# EAGLE board PC_adder (EAGLE 9.4.2), part 1 of 2
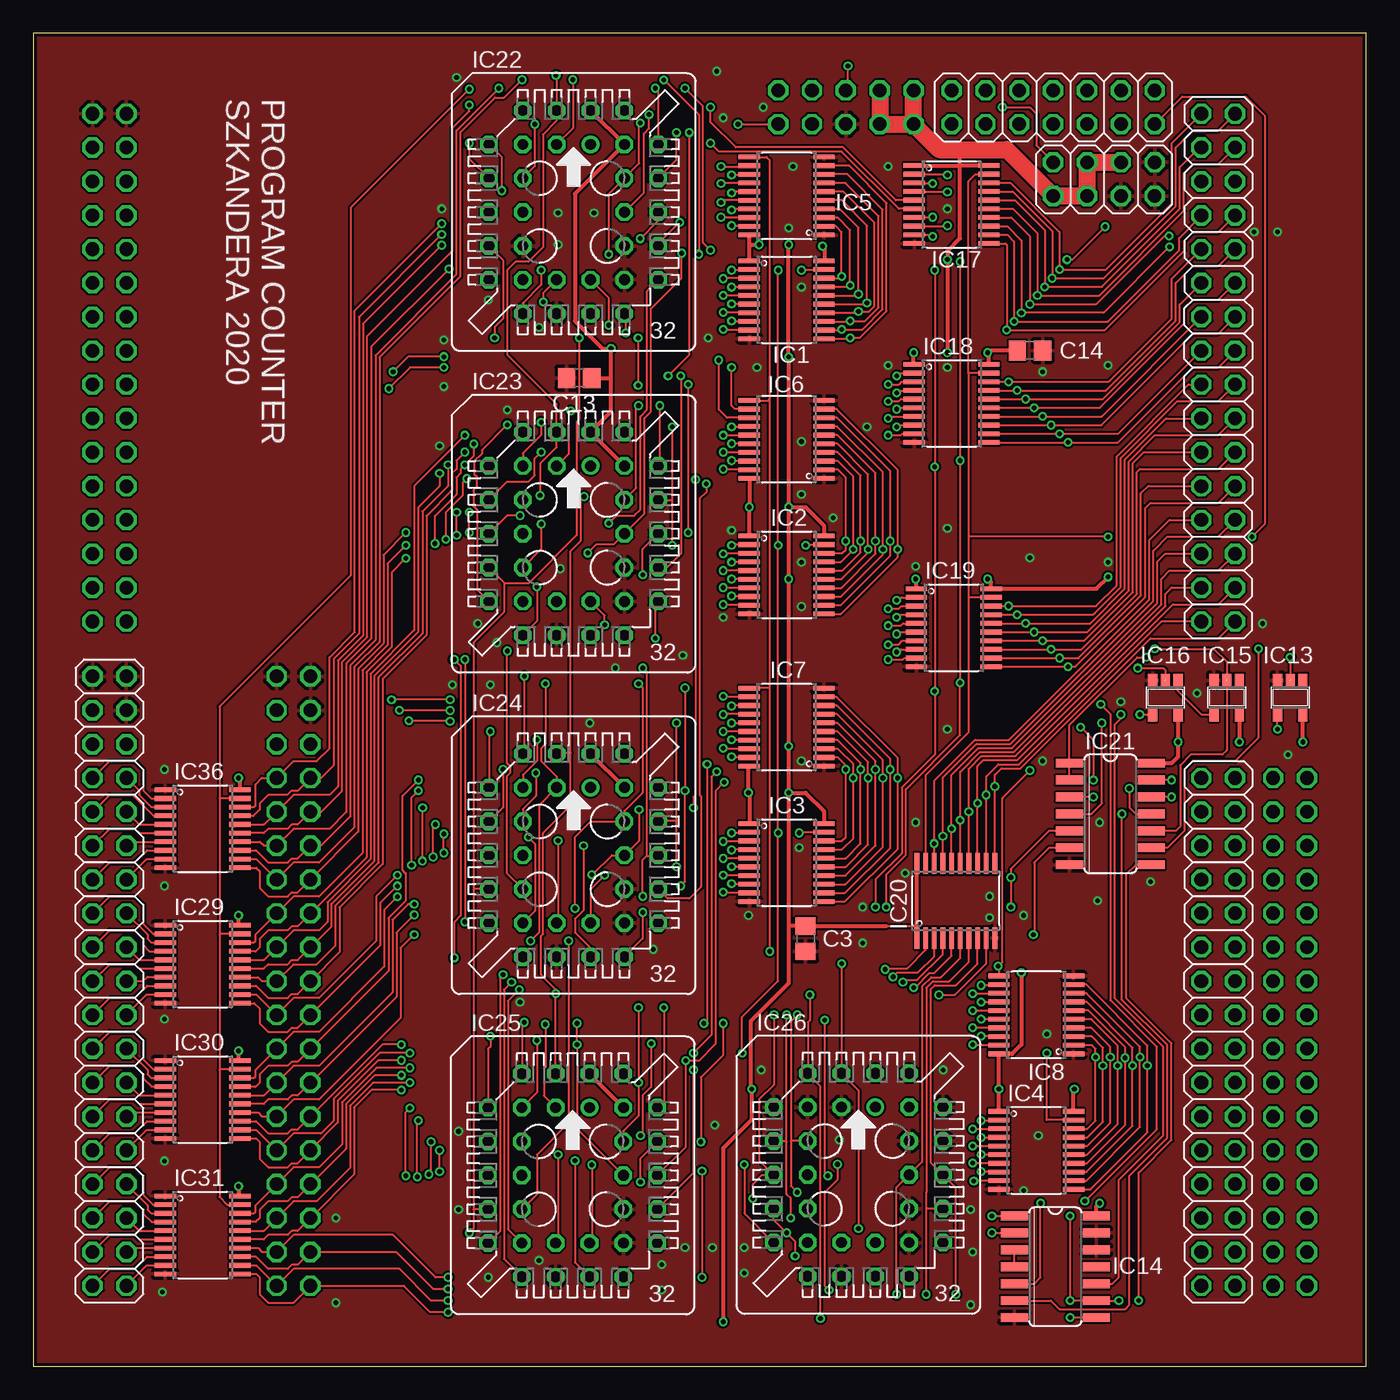
[diagram p2: board, top side]
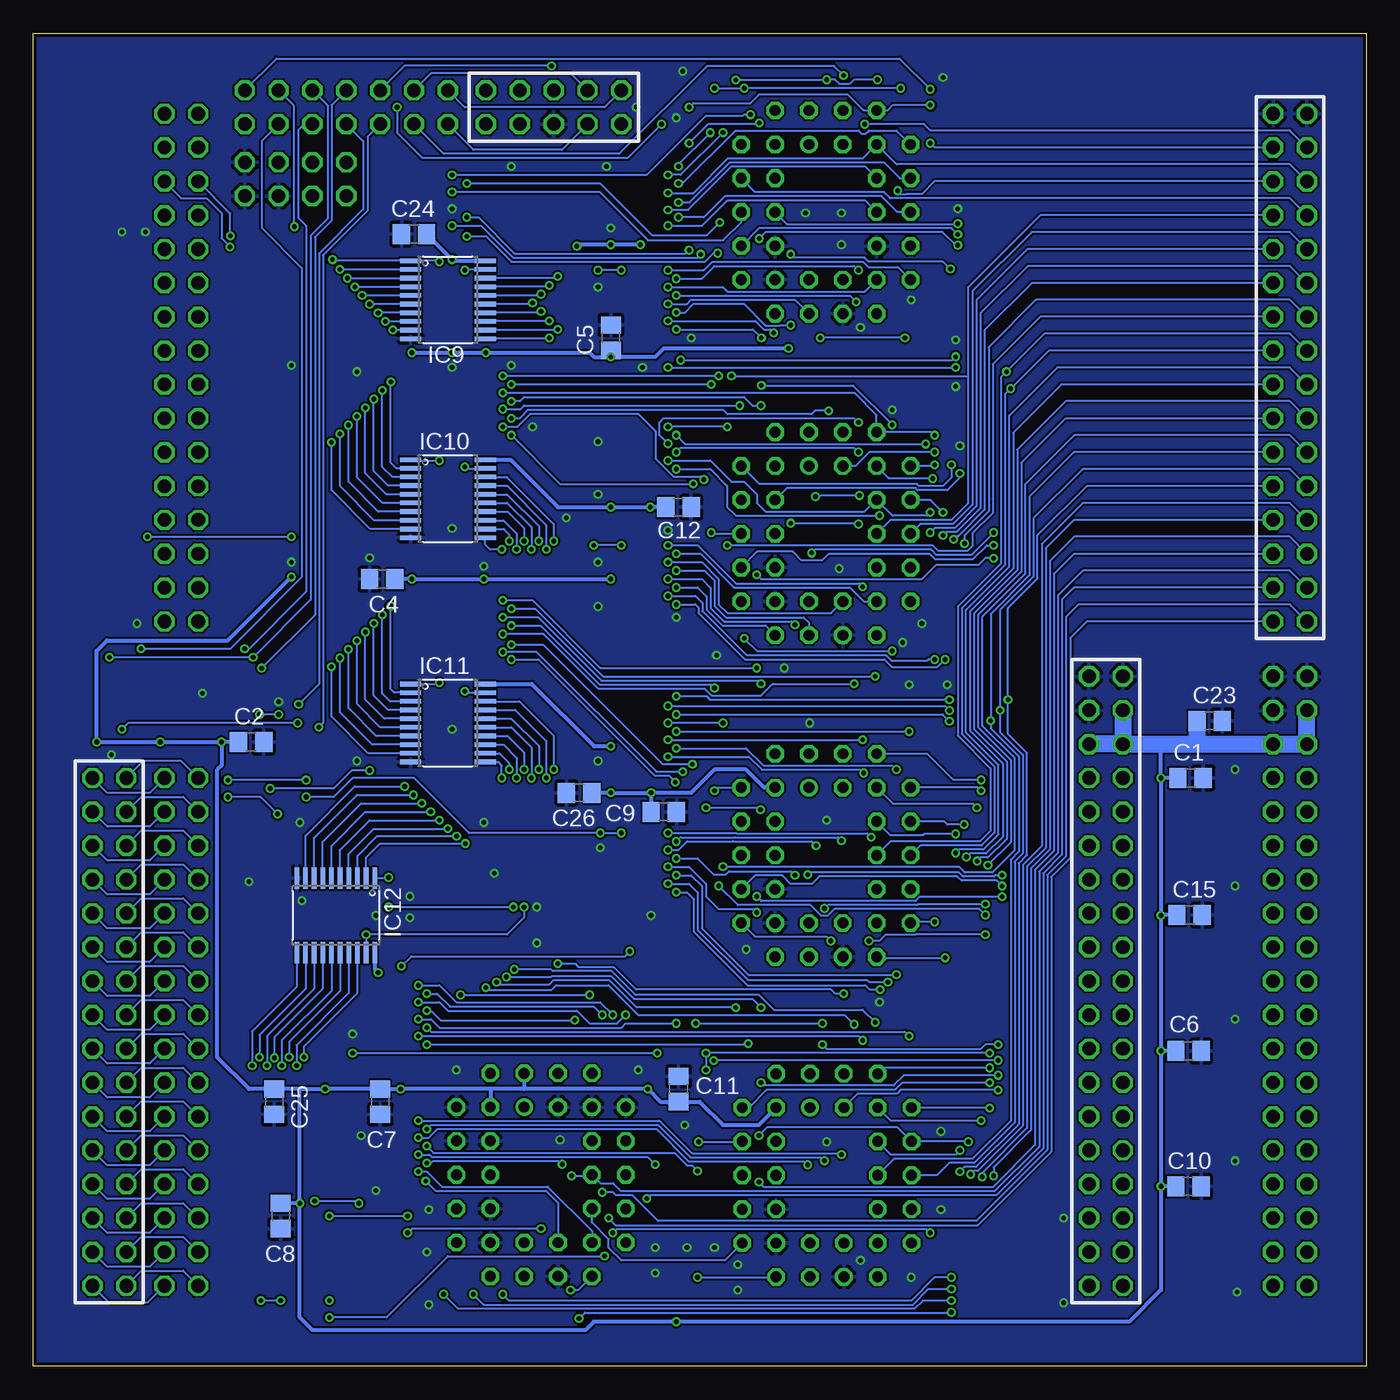
[diagram p3: board, bottom side, seen from below]

Size 100 x 100 mm. Coordinates in mm from the lower left corner, seen from the top.
Outline: 0,0 100,0 100,100 0,100 0,0
Copper layers (1*16): Top 0.035mm / dielectric 1.5mm / Bottom 0.035mm
Design rules "SeeedStudio_2layer_DRU_no_angle_20140221 *": minimum track width 6mil, minimum drill 12mil, track to track 6mil, track to pad 6mil, pad to pad 6mil, via to via 6mil, smd to smd 0mil, copper to edge 10mil, drill to drill 10mil, minimum pad ring 10mil, minimum via ring 6mil, stop-mask expansion 2mil, vias tented up to drill 100mil, thermal gap 10mil

## Footprints (pad centres in the part's own frame; a part is rotated, then mirrored left to right if it is on the bottom)
2X19 = drill 1.016 octagon: 1 -22.86,-1.27; 2 -22.86,1.27; 3 -20.32,-1.27; 4 -20.32,1.27; 5 -17.78,-1.27; 6 -17.78,1.27; 7 -15.24,-1.27; 8 -15.24,1.27; 9 -12.7,-1.27; 10 -12.7,1.27; 11 -10.16,-1.27; 12 -10.16,1.27; 13 -7.62,-1.27; 14 -7.62,1.27; 15 -5.08,-1.27; 16 -5.08,1.27; 17 -2.54,-1.27; 18 -2.54,1.27; 19 0,-1.27; 20 0,1.27; 21 2.54,-1.27; 22 2.54,1.27; 23 5.08,-1.27; 24 5.08,1.27; 25 7.62,-1.27; 26 7.62,1.27; 27 10.16,-1.27; 28 10.16,1.27; 29 12.7,-1.27; 30 12.7,1.27; 31 15.24,-1.27; 32 15.24,1.27; 33 17.78,-1.27; 34 17.78,1.27; 35 20.32,-1.27; 36 20.32,1.27; 37 22.86,-1.27; 38 22.86,1.27
C0805 = smd 1.3 x 1.5: 1 -0.95,0; 2 0.95,0
TSSOP20 = smd 0.35 x 1.6: 1 -2.925,-2.8; 2 -2.275,-2.8; 3 -1.625,-2.8; 4 -0.975,-2.8; 5 -0.325,-2.8; 6 0.325,-2.8; 7 0.975,-2.8; 8 1.625,-2.8; 9 2.275,-2.8; 10 2.925,-2.8; 11 2.925,2.8; 12 2.275,2.8; 13 1.625,2.8; 14 0.975,2.8; 15 0.325,2.8; 16 -0.325,2.8; 17 -0.975,2.8; 18 -1.625,2.8; 19 -2.275,2.8; 20 -2.925,2.8
SOT23-5 = smd 0.69 x 0.99: 1 -0.95,-1.29; 2 0,-1.29; 3 0.95,-1.29; 4 0.95,1.3; 5 -0.95,1.3
SO14 = smd 0.66 x 2.032: 1 -3.81,-3.073; 2 -2.54,-3.073; 3 -1.27,-3.073; 4 0,-3.073; 5 1.27,-3.073; 6 2.54,-3.073; 7 3.81,-3.073; 8 3.81,3.073; 9 2.54,3.073; 10 1.27,3.073; 11 0,3.073; 12 -1.27,3.073; 13 -2.54,3.073; 14 -3.81,3.073
S32 = drill 0.813: 1 1.27,5.08 | drill 0.813 octagon: 2 -1.27,7.62; 3 -1.27,5.08; 4 -3.81,7.62; 5 -6.35,5.08; 6 -3.81,5.08; 7 -6.35,2.54; 8 -3.81,2.54; 9 -6.35,0; 10 -3.81,0; 11 -6.35,-2.54; 12 -3.81,-2.54; 13 -6.35,-5.08; 14 -3.81,-7.62; 15 -3.81,-5.08; 16 -1.27,-7.62; 17 -1.27,-5.08; 18 1.27,-7.62; 19 1.27,-5.08; 20 3.81,-7.62; 21 6.35,-5.08; 22 3.81,-5.08; 23 6.35,-2.54; 24 3.81,-2.54; 25 6.35,0; 26 3.81,0; 27 6.35,2.54; 28 3.81,2.54; 29 6.35,5.08; 30 3.81,7.62; 31 3.81,5.08; 32 1.27,7.62
2X16 = drill 1.016 octagon: 1 -19.05,-1.27; 2 -19.05,1.27; 3 -16.51,-1.27; 4 -16.51,1.27; 5 -13.97,-1.27; 6 -13.97,1.27; 7 -11.43,-1.27; 8 -11.43,1.27; 9 -8.89,-1.27; 10 -8.89,1.27; 11 -6.35,-1.27; 12 -6.35,1.27; 13 -3.81,-1.27; 14 -3.81,1.27; 15 -1.27,-1.27; 16 -1.27,1.27; 17 1.27,-1.27; 18 1.27,1.27; 19 3.81,-1.27; 20 3.81,1.27; 21 6.35,-1.27; 22 6.35,1.27; 23 8.89,-1.27; 24 8.89,1.27; 25 11.43,-1.27; 26 11.43,1.27; 27 13.97,-1.27; 28 13.97,1.27; 29 16.51,-1.27; 30 16.51,1.27; 31 19.05,-1.27; 32 19.05,1.27
2X05 = drill 1.016 octagon: 1 -5.08,-1.27; 2 -5.08,1.27; 3 -2.54,-1.27; 4 -2.54,1.27; 5 0,-1.27; 6 0,1.27; 7 2.54,-1.27; 8 2.54,1.27; 9 5.08,-1.27; 10 5.08,1.27
2X04 = drill 1.016 octagon: 1 -3.81,-1.27; 2 -3.81,1.27; 3 -1.27,-1.27; 4 -1.27,1.27; 5 1.27,-1.27; 6 1.27,1.27; 7 3.81,-1.27; 8 3.81,1.27
2X07 = drill 1.016 octagon: 1 -7.62,-1.27; 2 -7.62,1.27; 3 -5.08,-1.27; 4 -5.08,1.27; 5 -2.54,-1.27; 6 -2.54,1.27; 7 0,-1.27; 8 0,1.27; 9 2.54,-1.27; 10 2.54,1.27; 11 5.08,-1.27; 12 5.08,1.27; 13 7.62,-1.27; 14 7.62,1.27

## Placement (x,y rotation side)
ALU_Y_C0  [2X19]  5.71,28.89 270 top
C1  [C0805]  13.18,44.13 0 bottom
C2  [C0805]  83.66,46.83 0 bottom
C3  [C0805]  57.94,32.07 270 top
C4  [C0805]  73.82,59.05 180 bottom
C5  [C0805]  56.67,77.15 90 bottom
C6  [C0805]  13.34,23.65 0 bottom
C7  [C0805]  73.98,19.84 270 bottom
C8  [C0805]  81.44,11.27 270 bottom
C9  [C0805]  52.7,41.59 0 bottom
C10  [C0805]  13.34,13.49 0 bottom
C11  [C0805]  51.59,20.8 90 bottom
C12  [C0805]  51.59,64.45 0 bottom
C13  [C0805]  40.96,74.14 180 top
C14  [C0805]  74.78,76.2 0 top
C15  [C0805]  13.26,33.86 0 bottom
C23  1u  [C0805]  11.75,48.42 0 bottom
C24  1u  [C0805]  71.44,84.93 180 bottom
C25  1u  [C0805]  81.92,19.84 270 bottom
C26  1u  [C0805]  59.05,43.02 180 bottom
IC1  74245  [TSSOP20]  56.52,80.01 270 top
IC2  74245  [TSSOP20]  56.52,59.37 270 top
IC3  74245  [TSSOP20]  56.52,37.78 270 top
IC4  74245  [TSSOP20]  75.25,16.19 270 top
IC5  74574  [TSSOP20]  56.52,87.79 90 top
IC6  74574  [TSSOP20]  56.52,69.53 90 top
IC7  74574  [TSSOP20]  56.52,47.94 90 top
IC8  74574  [TSSOP20]  75.25,26.35 90 top
IC9  74245  [TSSOP20]  68.9,80.01 270 bottom
IC10  74245  [TSSOP20]  68.9,65.09 270 bottom
IC11  74245  [TSSOP20]  68.9,48.26 270 bottom
IC12  74245  [TSSOP20]  77.31,33.81 180 bottom
IC13  74LVC1G04DBV  [SOT23-5]  94.3,50.16 180 top
IC14  74AC32D  [SO14]  76.68,7.46 270 top
IC15  74LVC1G04DBV  [SOT23-5]  89.53,50.16 180 top
IC16  74AHC1G08DBV  [SOT23-5]  84.93,50.16 180 top
IC17  74245  [TSSOP20]  68.9,87.15 270 top
IC18  74245  [TSSOP20]  68.9,72.23 270 top
IC19  74245  [TSSOP20]  69.06,55.4 270 top
IC20  74245  [TSSOP20]  69.22,34.92 0 top
IC21  74AC08D  [SO14]  80.8,41.43 270 top
IC22  [S32]  40.54,86.59 0 top
IC23  [S32]  40.54,62.46 0 top
IC24  [S32]  40.54,38.33 0 top
IC25  [S32]  40.46,14.32 0 top
IC26  [S32]  61.9,14.35 0 top
IC29  74245  [TSSOP20]  12.7,30.16 270 top
IC30  74245  [TSSOP20]  12.7,20 270 top
IC31  74245  [TSSOP20]  12.7,9.84 270 top
IC36  74245  [TSSOP20]  12.7,40.32 270 top
IMM_C0  [2X19]  19.53,28.89 270 top
INS_C0  [2X16]  94.3,25.08 270 top
INS_C1  [2X16]  88.9,25.08 270 top
PC_ADDR_C0  [2X16]  5.71,74.92 270 top
PROG_THR_C0  [2X05]  60.96,94.46 0 top
PWR_C0  [2X04]  80.33,89.06 0 top
RTB_BUS_C0  [2X16]  88.9,74.92 270 top
SIGNALS_C0  PINHD-2X7  [2X07]  76.52,94.46 0 top

## Tracks (layer width: path | path; a pad name or v marks a point on that pad's centre or on a via)
#ALU_SRC_IMM  (via drill 0.35)
  Top 0.152: v32.7,95.81 23.82,86.92 23.82,59.33 13.97,49.48 13.97,42.6 | IC36.19 13.97,42.6 | 13.97,42.6 13.97,32.38 | 13.97,32.38 13.97,22.23 | 13.97,22.23 13.97,12.7 14.55,12.12 IC31.19 | IC30.19 14.02,22.28 13.97,22.23 | IC29.19 14.02,32.44 13.97,32.38
  Bottom 0.152: SIGNALS_C0.14 81.75,98.11 35.01,98.11 v32.7,95.81
#IMM_RTB_G  (via drill 0.35)
  Top 0.152: IC20.19 66.94,44.33 70.17,47.56 70.17,57.68 | IC19.19 70.17,57.68 | 70.17,74.45 70.17,62.23 | 70.17,62.23 70.17,57.68 | 70.17,74.45 70.17,88.9 70.7,89.43 IC17.19 | IC18.19 70.22,74.51 70.17,74.45 | SIGNALS_C0.13 86.2,95.25 90.96,95.25 92.39,93.82 92.39,63.18 v91.44,62.23 | v80.64,62.23 70.17,62.23
  Bottom 0.152: v91.44,62.23 v80.64,62.23
#PC_RTB_G  (via drill 0.35)
  Top 0.152: v69.53,82.87 v69.53,67.94 v69.53,51.28 69.53,47.35 65.46,43.28 65.46,38.36 63.99,36.89 v63.99,34.45 | v73.34,34.45 v73.34,36.67 73.34,37.31 76.2,40.16 IC21.5 | v77.55,83.03 77.95,83.03 v80.42,85.5
  Bottom 0.152: IC11.1 69.62,51.19 v69.53,51.28 | v69.53,82.87 69.6,82.94 IC9.1 77.46,82.94 v77.55,83.03 | IC10.1 71.63,67.94 v69.53,67.94 | v73.34,34.45 v63.99,34.45 | IC12.1 73.4,36.61 v73.34,36.67 | SIGNALS_C0.12 80.49,94.61 80.49,85.57 v80.42,85.5
ALU_Y_0
  Top 0.152: ALU_Y_C0.7 5.71,45.4 7.62,45.4 8.26,44.77 8.26,43.18 8.84,42.6 IC36.2
ALU_Y_1
  Top 0.152: ALU_Y_C0.8 7.94,43.18 7.94,42.86 8.85,41.95 IC36.3
ALU_Y_2
  Top 0.152: ALU_Y_C0.9 5.71,42.86 7.46,42.86 9.03,41.3 IC36.4
ALU_Y_3
  Top 0.152: ALU_Y_C0.10 7.93,40.65 IC36.5
ALU_Y_4
  Top 0.152: ALU_Y_C0.11 5.71,40.32 7.62,40.32 7.95,40 IC36.6
ALU_Y_5
  Top 0.152: ALU_Y_C0.12 7.28,39.35 IC36.7
ALU_Y_6
  Top 0.152: ALU_Y_C0.13 5.71,37.78 7.62,37.78 8.54,38.7 IC36.8
ALU_Y_7
  Top 0.152: ALU_Y_C0.14 8.52,38.05 IC36.9
ALU_Y_8
  Top 0.152: ALU_Y_C0.15 5.71,35.24 7.62,35.24 8.26,34.61 8.26,33.18 9,32.44 IC29.2
ALU_Y_9
  Top 0.152: ALU_Y_C0.16 8.57,32.38 8.57,32.07 8.85,31.79 IC29.3
ALU_Y_10
  Top 0.152: ALU_Y_C0.17 5.71,32.7 7.62,32.7 8.26,32.07 8.26,31.59 8.71,31.14 IC29.4
ALU_Y_11
  Top 0.152: ALU_Y_C0.18 7.93,30.49 IC29.5
ALU_Y_12
  Top 0.152: ALU_Y_C0.19 5.71,30.16 7.62,30.16 7.95,29.84 IC29.6
ALU_Y_13
  Top 0.152: ALU_Y_C0.20 8.26,28.89 8.57,29.21 9.88,29.21 IC29.7
ALU_Y_14
  Top 0.152: ALU_Y_C0.21 5.71,27.62 7.62,27.62 8.54,28.54 IC29.8
ALU_Y_15
  Top 0.152: ALU_Y_C0.22 8.52,27.89 IC29.9
ALU_Y_16
  Top 0.152: ALU_Y_C0.23 5.71,25.08 7.62,25.08 8.26,24.45 8.26,23.02 9,22.28 IC30.2
ALU_Y_17
  Top 0.152: ALU_Y_C0.24 8.57,22.23 8.57,21.91 8.85,21.63 IC30.3
ALU_Y_18
  Top 0.152: ALU_Y_C0.25 5.71,22.54 7.62,22.54 8.26,21.91 8.26,21.59 8.87,20.98 IC30.4
ALU_Y_19
  Top 0.152: ALU_Y_C0.26 7.93,20.33 IC30.5
ALU_Y_20
  Top 0.152: ALU_Y_C0.27 5.71,20 7.62,20 7.95,19.68 IC30.6
ALU_Y_21
  Top 0.152: ALU_Y_C0.28 7.28,19.03 IC30.7
ALU_Y_22
  Top 0.152: ALU_Y_C0.29 5.71,17.46 7.62,17.46 8.54,18.38 IC30.8
ALU_Y_23
  Top 0.152: ALU_Y_C0.30 8.52,17.73 IC30.9
ALU_Y_24
  Top 0.152: ALU_Y_C0.31 5.71,14.92 7.62,14.92 8.26,14.29 8.26,12.86 9,12.12 IC31.2
ALU_Y_25
  Top 0.152: ALU_Y_C0.32 8.57,12.06 8.57,11.75 8.85,11.47 IC31.3
ALU_Y_26
  Top 0.152: ALU_Y_C0.33 5.71,12.38 7.62,12.38 8.26,11.75 8.26,11.43 8.87,10.82 IC31.4
ALU_Y_27
  Top 0.152: ALU_Y_C0.34 7.93,10.17 IC31.5
ALU_Y_28
  Top 0.152: ALU_Y_C0.35 5.71,9.84 7.62,9.84 7.95,9.52 IC31.6
ALU_Y_29
  Top 0.152: ALU_Y_C0.36 7.28,8.87 IC31.7
ALU_Y_30
  Top 0.152: ALU_Y_C0.37 5.71,7.3 7.62,7.3 8.54,8.22 IC31.8
ALU_Y_31
  Top 0.152: ALU_Y_C0.38 8.52,7.57 IC31.9
BRANCH  (via drill 0.35)
  Top 0.152: v91.92,53.82 91.92,47.15 90.17,45.4 87,45.4 86.36,44.77 86.36,40.16 85.09,38.89 IC21.9
  Bottom 0.152: SIGNALS_C0.11 82.87,91.92 82.87,85.41 79.85,82.39 79.85,59.21 85.25,53.82 v91.92,53.82
BRANCH1  (via drill 0.35)
  Top 0.152: v81.68,41.43 81.68,27.5 85.08,24.09 85.08,17.14 82.22,14.28 82.22,4.59 81.92,4.29 76.99,4.29 76.36,4.92 IC14.6 | v85.41,42.7 IC21.12
  Bottom 0.152: v81.68,41.43 82.95,42.7 v85.41,42.7
BRANCH2
  Top 0.152: IC15.4 87.66,48.87 85.88,50.64 IC16.1
BRCH&PC  (via drill 0.35)
  Top 0.152: IC14.10 80.96,6.19 81.44,6.67 81.44,13.97 84.78,17.31 84.78,23.97 81.12,27.62 81.12,48.1 81.6,48.58 v81.6,48.9 | v83.03,48.9 83.95,48.9 IC16.4
  Bottom 0.152: v81.6,48.9 v83.03,48.9
CLK  (via drill 0.35)
  Top 0.152: v78.58,47.94 79.53,46.99 v79.53,43.97 | v85.41,43.97 IC21.13
  Bottom 0.152: SIGNALS_C0.5 74.93,92.23 74.93,86.68 78.26,83.34 78.26,48.26 v78.58,47.94 | v79.53,43.97 v85.41,43.97
COUT_0  (via drill 0.35)
  Top 0.152: IC22.21 46.88,81.49 46.04,80.64 46.04,71.75 45.54,71.26 45.54,64.27 45.09,63.82 43.75,63.82 v43.18,63.25 | v38.1,63.18 38.1,61.29 IC23.12
  Bottom 0.152: v43.18,63.25 38.17,63.25 v38.1,63.18
COUT_1  (via drill 0.35)
  Top 0.152: IC24.12 35.56,36.95 35.56,44.3 35.8,44.54 35.8,45 35.56,45.24 v35.56,53.66 | v46.67,54.61 46.67,57.17 IC23.21
  Bottom 0.152: v46.67,54.61 45.72,53.66 v35.56,53.66
COUT_2  (via drill 0.35)
  Top 0.152: v40.16,31.91 40.16,18.26 37.78,15.88 37.78,12.91 IC25.12
  Bottom 0.152: IC24.21 45.86,32.23 40.48,32.23 v40.16,31.91
COUT_3
  Bottom 0.152: IC25.21 48.11,7.94 55.88,7.94 56.83,8.89 56.83,9.53 58.09,10.78 IC26.12
GND  (via drill 0.35)
  other vias: 91.6,85.09 75.72,74.61 80.64,75.09 68.58,74.93 64.14,75.09 68.58,86.84 64.14,90.01 56.99,90.01 54.77,94.46 51.75,93.66 56.67,85.41 57.63,80.96 50.64,77.15 54.29,74.93 57.63,69.37 57.63,65.41 52.39,62.71 57.63,60.33 57.63,56.99 51.75,56.2 48.74,53.34 43.66,52.39 34.77,54.29 33.34,55.72 34.29,51.12 31.43,51.12 39.53,59.85 68.58,62.87 66.2,60.01 74.77,60.64 80.64,60.33 81.6,49.85 75.72,45.4 68.58,47.78 80.01,40.8 79.85,34.92 74.3,33.81 71.75,33.66 71.75,35.24 62.23,34.45 65.41,36.99 66.2,40.8 57.47,38.89 53.66,33.81 62.23,31.75 54.61,22.23 51.12,18.1 50.96,8.89 53.34,8.89 48.9,8.89 47.15,7.62 53.34,6.99 47.15,5.71 37.94,7.94 34.13,6.67 31.91,11.75 31.91,17.62 40.48,16.83 46.51,31.27 36.51,27.3 40.48,40.96 41.75,48.26 57.63,45.4 37.94,77.95 42.07,86.52 39.37,86.52 34.13,80.01 39.37,84.14 35.56,71.75 30.48,69.06 60.48,16.99 93.34,85.09 51.28,97.16 31.75,96.68 30.64,86.84 30.8,76.99 30.8,73.5 9.84,36.04 9.84,44.77 9.84,26.04 9.84,15.4 9.68,5.56 22.7,4.76 22.7,11.11 70.33,4.6 70.48,8.57 74.3,13.18 70.33,11.75 75.41,17.3 68.26,22.23 76.04,24.92 83.82,36.35 87.31,50.48 92.23,55.72 94.14,45.88 62.55,70.48 60.01,63.66
  pour Bottom: -1.75,107.63 106.52,107.63 106.52,66.67 106.52,-6.19 52.7,-6.19 -1.75,-6.19
  pour Top: -2.06,108.11 108.58,108.11 108.58,-7.46 -2.06,-7.46
IMM_0  (via drill 0.35)
  Top 0.152: IC22.26 45.81,88.06 45.81,92.48 46.2,92.87 v46.2,93.9 | v30.64,85.72 24.12,79.21 24.12,55.08 22.23,53.18 22.23,46.35 21.27,45.4 19.53,45.4 IMM_C0.7 17.14,44.13 16.67,43.66 16.67,42.07 16.55,41.95 IC36.18 | IC17.2 68.53,89.43 v68.58,89.38
  Bottom 0.152: IC22.26 43.46,85.7 30.66,85.7 v30.64,85.72 | v68.58,89.38 53.98,89.38 49.53,93.82 46.75,93.82 46.67,93.9 v46.2,93.9
IMM_1  (via drill 0.35)
  Top 0.152: v48.5,85.82 46.88,84.21 IC22.23 | v30.64,84.92 24.43,78.71 24.43,54.95 22.54,53.07 22.54,45.09 21.59,44.13 IMM_C0.8 19.83,43.17 19.36,43.17 19.05,42.86 17.62,42.86 16.99,42.23 16.99,41.75 16.51,41.27 15.52,41.27 IC36.17 | IC17.3 66.14,88.74 v67.47,88.74
  Bottom 0.152: v30.64,84.92 31.12,85.39 45.54,85.39 IC22.23 | v67.47,88.74 57.47,88.74 53.59,84.87 49.45,84.87 v48.5,85.82
IMM_2  (via drill 0.35)
  Top 0.152: v30.64,84.11 24.73,78.2 24.73,54.83 22.86,52.95 22.86,43.5 22.23,42.86 19.53,42.86 IMM_C0.9 17.31,40.65 IC36.16 | v45.55,84.6 46.88,85.94 IC22.25 | IC17.4 68.56,88.13 v68.58,88.11
  Bottom 0.152: v30.64,84.11 30.8,84.11 31.78,85.09 45.06,85.09 v45.55,84.6 | v68.58,88.11 57.52,88.11 53.89,84.47 48.24,84.47 46.88,85.83 IC22.25
IMM_3  (via drill 0.35)
  Top 0.152: v32.7,94.61 32.7,94.14 31.43,92.87 31.43,83.66 25.06,77.29 25.06,54.72 23.16,52.83 23.16,43.17 21.59,41.59 IMM_C0.10 19.83,40.63 19.4,40.63 19.09,40.32 17.62,40.32 17.3,40 IC36.15 | IC17.5 64.72,87.48 60.76,91.44 52.7,91.44 50.8,93.34 v50.8,94.46
  Bottom 0.152: v32.7,94.61 35.52,94.61 35.93,94.21 IC22.4 37.69,94.21 38.89,95.41 45.56,95.41 46.2,94.77 50.48,94.77 v50.8,94.46
IMM_4  (via drill 0.35)
  Top 0.152: v43.18,83.42 43.18,87.96 IC22.28 45.46,90.24 45.46,93.19 v45.53,93.27 | v31.19,82.32 25.36,76.49 25.36,54.59 23.47,52.7 23.47,41.57 22.23,40.32 19.53,40.32 IMM_C0.11 17.3,39.05 17.01,39.35 IC36.14 | IC17.6 64.94,86.83 60.64,91.12 51.44,91.12 v50.8,91.76
  Bottom 0.152: v31.19,82.32 31.74,82.87 37.34,82.87 37.64,83.17 42.93,83.17 v43.18,83.42 | v50.8,91.76 49.37,93.19 45.77,93.19 45.69,93.27 v45.53,93.27
IMM_5  (via drill 0.35)
  Top 0.152: v34.92,95.89 31.75,92.71 31.75,81.92 25.67,75.83 25.67,54.47 23.77,52.58 23.77,41.24 21.59,39.05 IMM_C0.12 19.83,38.09 19.4,38.09 19.09,37.78 17.62,37.78 16.71,38.7 IC36.13 | v46.67,95.89 46.88,95.67 46.88,93.66 IC22.29 | IC17.7 66.12,86.2 v67.47,86.2 | v50.8,83.73 50.23,84.3 50.23,94.55 v48.9,95.89
  Bottom 0.152: v34.92,95.89 v46.67,95.89 v48.9,95.89 | v67.47,86.2 66.61,86.2 63.88,83.48 51.05,83.48 v50.8,83.73
IMM_6  (via drill 0.35)
  Top 0.152: v36.67,96.52 v36.66,96.52 35.31,95.17 34.64,95.17 32.05,92.58 32.05,81.79 25.97,75.7 25.97,54.34 24.08,52.45 24.08,40.43 21.43,37.78 19.53,37.78 IMM_C0.13 16.72,38.05 IC36.12 | IC22.3 40.48,92.89 v40.48,96.52 | IC17.8 68.54,85.53 v68.58,85.57 | v49.93,83.42 49.93,93.89 v47.31,96.51
  Bottom 0.152: v36.67,96.52 38.42,96.52 38.73,96.2 39.53,96.2 39.85,96.52 v40.48,96.52 47.3,96.52 v47.31,96.51 | v68.58,85.57 66.4,85.57 64.01,83.17 50.18,83.17 v49.93,83.42
IMM_7  (via drill 0.35)
  Top 0.152: v41.59,61.01 42.23,61.65 43.53,61.65 IC23.26 45.84,63.96 45.84,71.13 46.34,71.63 46.34,79.36 48.59,81.61 48.59,83.44 v48.66,83.5 | v27.95,62.55 26.28,60.87 26.28,54.22 24.38,52.32 24.38,40.1 IMM_C0.14 19.84,35.55 19.4,35.55 19.09,35.24 17.62,35.24 16.99,35.88 16.99,37.15 16.74,37.4 IC36.11 | IC17.9 67.36,84.88 v67.47,84.77
  Bottom 0.152: v41.59,61.01 41.34,61.27 32.64,61.27 32.24,60.86 29.62,60.86 27.95,62.54 v27.95,62.55 | v67.47,84.77 66.04,84.77 64.14,82.87 49.61,82.87 48.97,83.5 v48.66,83.5
IMM_8  (via drill 0.35)
  Top 0.152: v48.58,74.3 48.58,60.96 47.54,59.92 IC23.23 | v27.95,61.58 26.58,60.21 26.58,54.09 24.69,52.2 24.69,38.5 21.43,35.24 19.53,35.24 IMM_C0.15 16.67,32.38 16.67,31.91 16.55,31.79 IC29.18 | v64.77,74.3 64.98,74.51 IC18.2
  Bottom 0.152: IC23.23 45.7,61.11 43.01,61.11 42.36,60.46 40.83,60.46 40.32,60.96 32.76,60.96 32.36,60.56 29.5,60.56 28.48,61.58 v27.95,61.58 | v48.58,74.3 v64.77,74.3
IMM_9  (via drill 0.35)
  Top 0.152: v45.72,59.37 45.72,61.29 IC23.25 | v49.13,73.66 v49.13,62.55 | v27.95,60.62 26.89,59.55 26.89,53.96 24.99,52.07 24.99,38.17 IMM_C0.16 19.83,33.01 19.4,33.01 19.09,32.7 17.62,32.7 16.99,32.07 16.99,31.43 16.67,31.11 15.52,31.11 IC29.17 | v64.14,73.66 64.93,73.66 65.12,73.86 IC18.3
  Bottom 0.152: v45.72,59.37 45.38,59.03 33.36,59.03 32.25,60.14 29.06,60.14 28.59,60.62 v27.95,60.62 | v49.13,73.66 v64.14,73.66 | v49.13,62.55 49.05,62.46 IC23.25
IMM_10  (via drill 0.35)
  Top 0.152: v32.38,69.85 28.65,66.12 | 28.65,66.12 28.57,66.04 | 28.65,66.12 28.57,66.04 | 28.57,66.04 28.57,55.22 25.3,51.94 25.3,38.04 22.07,34.81 22.07,33.34 21.43,32.7 19.53,32.7 IMM_C0.17 17.31,30.49 IC29.16 | v64.77,73.03 64.95,73.21 IC18.4
  Bottom 0.152: v32.38,69.85 32.61,70.08 IC23.4 36.73,71.35 38.4,73.03 v64.77,73.03
IMM_11  (via drill 0.35)
  Top 0.152: v30.48,66.99 30.48,66.04 28.89,64.45 28.89,55.11 25.6,51.82 25.6,37.92 22.37,34.69 22.37,33.01 IMM_C0.18 19.84,30.47 19.4,30.47 19.09,30.16 17.62,30.16 17.3,29.84 IC29.15 | IC23.28 45.23,65.89 45.23,71.9 v45.4,72.07 | v64.14,72.39 64.93,72.39 65.09,72.56 IC18.5
  Bottom 0.152: IC23.28 43.46,65.89 33.82,65.89 33.65,65.72 31.43,65.72 30.48,66.67 v30.48,66.99 | v64.14,72.39 63.5,72.39 63.18,72.71 46.67,72.71 46.04,72.07 v45.4,72.07
IMM_12  (via drill 0.35)
  Top 0.152: v31.11,67.63 31.11,66.04 29.2,64.12 29.2,54.98 25.91,51.69 25.91,37.79 22.68,34.56 22.68,31.57 21.27,30.16 19.53,30.16 IMM_C0.19 17.14,28.89 16.85,29.19 IC29.14 | v46.99,72.07 46.99,67.64 IC23.29 | v64.77,71.81 64.86,71.91 IC18.6
  Bottom 0.152: 45.54,66.19 45.55,66.21 | 45.55,66.21 IC23.29 | v46.99,72.07 63.18,72.07 63.5,71.75 64.71,71.75 v64.77,71.81 | 45.54,66.19 45.55,66.21 | v31.11,67.63 31.11,66.67 31.75,66.04 33.54,66.04 33.69,66.19 45.54,66.19
IMM_13  (via drill 0.35)
  Top 0.152: v32.38,68.58 31.75,67.94 31.75,67.31 31.43,66.99 31.43,65.72 29.5,63.79 29.5,54.85 26.21,51.56 26.21,37.66 22.98,34.43 22.98,31.06 IMM_C0.20 | v40.32,71.68 40.24,71.68 40.15,71.59 40.15,68.43 IC23.3 | v64.14,71.12 64.27,71.26 IC18.7 | IC29.13 16.71,28.54 17.62,27.62 19.09,27.62 19.4,27.93 19.84,27.93 IMM_C0.20 | IMM_C0.20
  Bottom 0.152: IC23.3 38.31,67.54 37.27,68.58 v32.38,68.58 | v64.14,71.12 63.5,71.12 62.87,71.75 48.26,71.75 47.93,71.42 41.6,71.42 41.35,71.68 v40.32,71.68
IMM_14  (via drill 0.35)
  Top 0.152: v41.91,36.88 41.96,36.88 43.41,38.33 IC24.26 45.44,39.42 v45.44,41.75 | v49.69,66.52 49.69,42.86 49.53,42.7 v49.53,41.91 | v27.3,36.83 25.72,35.25 25.72,31.91 21.43,27.62 19.53,27.62 IMM_C0.21 16.72,27.89 IC29.12 | v64.77,70.48 64.89,70.61 IC18.8
  Bottom 0.152: v27.3,36.83 27.83,36.83 27.92,36.73 30.24,36.73 30.57,37.06 41.73,37.06 v41.91,36.88 | v64.77,70.48 63.66,70.48 62.69,71.45 54.62,71.45 53.33,70.15 53.33,68.1 51.98,66.75 49.93,66.75 v49.69,66.52 | v49.53,41.91 49.21,41.91 45.6,41.91 v45.44,41.75
IMM_15  (via drill 0.35)
  Top 0.152: v50.5,66.2 50.5,65.58 49.99,65.08 49.99,42.87 50.09,42.77 50.09,35.96 49.21,35.08 47.59,35.08 IC24.23 | v27.3,36.02 v27.29,36.02 26.03,34.76 26.03,31.59 IMM_C0.22 19.83,25.39 19.4,25.39 19.09,25.08 17.62,25.08 16.99,25.72 16.99,26.83 16.58,27.24 IC29.11 | v64.14,69.85 65.09,69.85 65.19,69.96 IC18.9
  Bottom 0.152: v27.3,36.02 27.71,36.43 30.37,36.43 30.69,36.76 41.03,36.76 41.59,36.2 43.18,36.2 43.8,36.82 45.86,36.82 IC24.23 | v64.14,69.85 60.48,66.2 v50.5,66.2
IMM_16  (via drill 0.35)
  Top 0.152: v45.72,52.39 46,52.11 46,38.27 | 46,38.27 45.72,37.99 v45.72,35.24 | 46,38.27 46.82,38.27 IC24.25 | v27.3,35.22 26.33,34.24 26.33,29.98 21.43,25.08 19.53,25.08 IMM_C0.23 16.67,22.23 16.67,21.75 16.55,21.63 IC30.18 | v64.77,57.47 64.93,57.47 65.14,57.68 IC19.2
  Bottom 0.152: v27.3,35.22 33.5,35.22 33.82,34.9 45.38,34.9 v45.72,35.24 | v64.77,57.47 62.55,57.47 57.47,52.39 v45.72,52.39
IMM_17  (via drill 0.35)
  Top 0.152: v28.89,43.99 27.7,42.79 27.7,37.22 27.94,36.98 27.94,34.92 26.64,33.62 26.64,29.65 IMM_C0.24 19.83,22.85 19.4,22.85 19.09,22.54 17.62,22.54 16.99,21.91 16.99,21.27 16.67,20.95 15.52,20.95 IC30.17 | v36.83,51.75 36.83,46.05 IC24.4 | v64.14,56.83 64.93,56.83 65.12,57.03 IC19.3
  Bottom 0.152: v28.89,43.99 30.97,43.99 32.93,45.95 IC24.4 | v64.14,56.83 62.34,56.83 57.26,51.75 v36.83,51.75
IMM_18  (via drill 0.35)
  Top 0.152: v28.57,34.66 28.11,34.66 26.94,33.5 26.94,28.05 21.43,22.54 19.53,22.54 IMM_C0.25 17.31,20.33 IC30.16 | v40.64,34.34 40.64,39.7 41.8,40.87 IC24.28 44.34,41.66 45.69,43.01 45.69,50.91 v45.4,51.2 | v64.77,56.2 64.93,56.2 65.11,56.38 IC19.4
  Bottom 0.152: v28.57,34.66 33.63,34.66 33.69,34.59 40.39,34.59 v40.64,34.34 | v64.77,56.2 62.14,56.2 57.38,51.44 45.64,51.44 v45.4,51.2
IMM_19  (via drill 0.35)
  Top 0.152: v48.58,36.04 48.9,36.35 v48.9,43.18 v48.9,50.88 | v28.57,33.85 27.25,32.52 27.25,27.72 IMM_C0.26 19.83,20.31 19.4,20.31 19.09,20 17.62,20 17.3,19.68 IC30.15 | v64.14,55.56 65.09,55.56 65.25,55.73 IC19.5
  Bottom 0.152: v28.57,33.85 29.01,34.29 39.91,34.29 40.41,33.79 40.87,33.79 41.68,34.59 47.14,34.59 v48.58,36.04 | v48.9,43.18 48.67,43.41 IC24.29 | v64.14,55.56 61.94,55.56 57.5,51.13 49.15,51.13 v48.9,50.88
IMM_20  (via drill 0.35)
  Top 0.152: v37.31,31.91 37.94,32.54 37.94,42.09 IC24.3 39.27,44.24 38.1,45.4 38.1,46.35 38.42,46.67 v38.42,51.2 | v28.57,32.38 27.55,31.36 27.55,26.12 21.43,20 19.53,20 IMM_C0.27 17.14,18.73 16.85,19.03 IC30.14 | v64.77,54.93 64.93,54.93 65.08,55.08 IC19.6
  Bottom 0.152: v28.57,32.38 33.79,32.38 33.82,32.36 36.06,32.36 36.51,31.91 v37.31,31.91 | v64.77,54.93 61.73,54.93 57.63,50.83 49.63,50.83 49.12,50.32 45.4,50.32 44.53,51.2 v38.42,51.2
IMM_21  (via drill 0.35)
  Top 0.152: IC25.26 40.8,17.79 v40.8,24.13 v40.8,25.72 | v50.55,45.16 50.55,25.96 v50.31,25.72 | v27.62,24.13 26.19,24.13 IMM_C0.28 19.84,17.77 19.4,17.77 19.09,17.46 17.62,17.46 16.71,18.38 IC30.13 | v64.14,54.13 64.93,54.13 65.22,54.43 IC19.7
  Bottom 0.152: v40.8,24.13 40.48,23.81 28.89,23.81 28.57,24.13 v27.62,24.13 | v64.14,54.13 61.75,54.13 52.78,45.16 v50.55,45.16 | v50.31,25.72 v40.8,25.72
IMM_22  (via drill 0.35)
  Top 0.152: v51.28,44.61 50.88,44.21 50.88,24.84 v49.53,23.5 | IC25.23 49.53,14.5 v49.53,22.23 | v28.26,23.5 25.99,23.5 22.54,20.05 22.54,18.41 21.59,17.46 19.53,17.46 IMM_C0.29 16.72,17.73 IC30.12 | v64.77,53.58 64.93,53.58 65.13,53.78 IC19.8
  Bottom 0.152: v28.26,23.5 v49.53,23.5 v49.53,22.23 | v64.77,53.58 62.23,53.58 53.26,44.61 v51.28,44.61
IMM_23  (via drill 0.35)
  Top 0.152: IC25.25 48.96,16.47 v48.96,22.92 49.93,22.92 51.18,24.18 51.18,43.17 v51.83,43.81 | v27.62,22.94 25.86,22.94 22.85,19.92 22.85,18.29 20.8,16.24 IMM_C0.30 19.84,15.23 19.4,15.23 19.09,14.92 17.62,14.92 16.99,15.56 16.99,16.83 16.74,17.08 IC30.11 | v64.14,53.02 65.25,53.02 65.35,53.13 IC19.9
  Bottom 0.152: v27.62,22.94 48.94,22.94 v48.96,22.92 | v64.14,53.02 62.1,53.02 53.39,44.3 52.32,44.3 v51.83,43.81
IMM_24  (via drill 0.35)
  Top 0.152: v36.83,25.8 36.65,25.62 IC25.4 | v63.92,29.77 63.99,29.84 65.56,29.84 66.94,31.22 IC20.2 | v28.26,22.38 25.74,22.38 23.15,19.8 23.15,16.64 21.43,14.92 19.53,14.92 IMM_C0.31 16.67,12.06 16.67,11.59 16.55,11.47 IC31.18
  Bottom 0.152: v28.26,22.38 36.21,22.38 IC25.4 | v36.83,25.8 37.78,26.75 44.45,26.75 45.55,27.85 54.8,27.85 56.6,29.65 61.03,29.65 61.15,29.77 v63.92,29.77
IMM_25  (via drill 0.35)
  Top 0.152: IC25.28 44.27,17.65 45.4,18.78 v45.4,21.27 v45.4,26.91 | v64.5,29.21 64.82,29.53 66.36,29.53 67.59,30.76 IC20.3 | v27.62,21.83 25.61,21.83 23.46,19.67 23.46,16.31 IMM_C0.32 19.83,12.69 19.4,12.69 19.09,12.38 17.62,12.38 16.99,11.75 16.99,11.11 16.69,10.82 IC31.17
  Bottom 0.152: v27.62,21.83 34.69,21.83 35.47,21.05 45.18,21.05 v45.4,21.27 | v45.4,26.91 46.04,27.54 54.93,27.54 56.66,29.28 61.09,29.28 61.15,29.21 v64.5,29.21
IMM_26  (via drill 0.35)
  Top 0.152: v47.31,26.91 47.31,19.89 IC25.29 | v65.25,28.81 65.41,28.97 66.3,28.97 68.24,30.91 IC20.4 | v28.26,21.27 25.49,21.27 23.76,19.54 23.76,14.87 21.27,12.38 19.53,12.38 IMM_C0.33 17.31,10.17 IC31.16
  Bottom 0.152: v28.26,21.27 34.81,21.27 35.34,20.75 44.98,20.75 46.32,19.4 IC25.29 | v47.31,26.91 54.74,26.91 56.81,28.97 60.96,28.97 61.28,28.66 65.09,28.66 v65.25,28.81
IMM_27  (via drill 0.35)
  Top 0.152: v38.42,25.64 38.42,22.42 38.3,22.31 38.3,20.29 IC25.3 | v66.04,28.39 66.15,28.39 67.25,29.49 67.59,29.49 68.89,30.79 IC20.5 | v27.62,20.71 25.36,20.71 24.07,19.42 24.07,14.38 IMM_C0.34 19.83,10.15 19.4,10.15 19.09,9.84 17.62,9.84 17.3,9.52 IC31.15
  Bottom 0.152: v27.62,20.71 34.94,20.71 35.21,20.44 38.15,20.44 IC25.3 | v38.42,25.64 39.13,26.35 54.62,26.35 56.84,28.58 60.78,28.58 61.12,28.23 65.88,28.23 v66.04,28.39
IMM_28  (via drill 0.35)
  Top 0.152: v64.77,5.4 64.77,13.41 IC26.26 66.67,15.32 66.67,28.48 67.38,29.18 68.08,29.18 69.54,30.65 IC20.6 | v31.11,6.67 30.16,6.67 26.99,9.84 19.53,9.84 IMM_C0.35 17.14,8.57 16.85,8.87 IC31.14
  Bottom 0.152: v31.11,6.67 32.38,6.67 34.13,4.92 64.29,4.92 v64.77,5.4
IMM_29  (via drill 0.35)
  Top 0.152: v66.99,5.4 66.99,11.91 | 66.99,11.91 66.99,13.05 67,13.06 67,28.38 67.5,28.88 68.73,28.88 70.19,30.34 IC20.7 | IC26.23 67.08,11.81 66.99,11.91 | v31.11,5.79 30,5.79 27.23,8.57 IMM_C0.36 19.83,7.61 19.4,7.61 19.09,7.3 17.62,7.3 16.71,8.22 IC31.13
  Bottom 0.152: v66.99,5.4 66.21,4.62 34.01,4.62 32.83,5.79 v31.11,5.79
IMM_30  (via drill 0.35)
  Top 0.152: v69.22,5.4 69.22,13.39 IC26.25 67.31,15.29 67.31,28.26 67.63,28.57 69.22,28.57 70.84,30.2 IC20.8 | v31.11,4.92 29.85,4.92 27.46,7.3 19.53,7.3 IMM_C0.37 16.72,7.57 IC31.12
  Bottom 0.152: v31.11,4.92 33.27,4.92 33.88,4.31 68.13,4.31 v69.22,5.4
IMM_31  (via drill 0.35)
  Top 0.152: v59.05,3.57 59.05,21.01 IC26.4 58.09,22.13 58.1,22.15 58.1,25.8 58.26,25.96 v58.26,27.86 | v67.94,27.86 69.14,27.86 71.49,30.21 IC20.9 | v31.11,4.05 29.77,4.05 27.78,6.03 IMM_C0.38 19.53,4.76 17.62,4.76 16.99,5.4 16.99,6.67 16.74,6.92 IC31.11
  Bottom 0.152: v58.26,27.86 58.28,27.84 67.94,27.84 v67.94,27.86 | v59.05,3.57 58.62,4.01 31.16,4.01 v31.11,4.05
IMM_GEN_CTR_0
  Bottom 0.152: PROG_THR_C0.2 57.15,94.46 67.63,94.46 SIGNALS_C0.2
IMM_GEN_CTR_1
  Bottom 0.152: PROG_THR_C0.4 59.69,97 70.17,97 SIGNALS_C0.4
IMM_GEN_CTR_2  (via drill 0.35)
  Top 0.152: PROG_THR_C0.6 61.12,95.89 v61.12,97.55
  Bottom 0.152: v61.12,97.55 72.15,97.55 SIGNALS_C0.6
INS_0
  Bottom 0.152: INS_C1.1 88.9,45.4 91.76,45.4 INS_C0.1
INS_1
  Bottom 0.152: INS_C1.2 91.28,43.02 94.46,43.02 INS_C0.2
INS_2
  Bottom 0.152: INS_C0.3 91.9,42.72 88.75,42.72 INS_C1.3
INS_3
  Bottom 0.152: INS_C1.4 91.28,40.48 94.46,40.48 INS_C0.4
INS_4
  Bottom 0.152: INS_C0.5 91.9,40.18 88.75,40.18 INS_C1.5
INS_5
  Bottom 0.152: INS_C1.6 91.28,37.94 94.46,37.94 INS_C0.6
INS_6
  Bottom 0.152: INS_C0.7 91.9,37.64 88.75,37.64 INS_C1.7
INS_25
  Bottom 0.152: INS_C1.26 91.28,12.54 94.46,12.54 INS_C0.26
INS_26
  Bottom 0.152: INS_C0.27 91.9,12.24 88.75,12.24 INS_C1.27
INS_27
  Bottom 0.152: INS_C1.28 91.28,10 94.46,10 INS_C0.28
INS_28
  Bottom 0.152: INS_C0.29 91.9,9.7 88.75,9.7 INS_C1.29
INS_29
  Bottom 0.152: INS_C1.30 91.28,7.46 94.46,7.46 INS_C0.30
INS_31
  Bottom 0.152: INS_C1.32 91.44,4.76 94.3,4.76 INS_C0.32
INS_F3_0
  Bottom 0.152: INS_C0.13 91.9,30.02 88.75,30.02 INS_C1.13
INS_F3_1
  Bottom 0.152: INS_C1.14 91.28,27.78 94.46,27.78 INS_C0.14
INS_F3_2
  Bottom 0.152: INS_C0.15 91.9,27.48 88.75,27.48 INS_C1.15
INS_I
  Bottom 0.152: INS_C0.31 91.9,7.16 88.75,7.16 INS_C1.31
INS_R1_0
  Bottom 0.152: INS_C1.16 91.28,25.24 94.46,25.24 INS_C0.16
INS_R1_1
  Bottom 0.152: INS_C0.17 91.9,24.94 88.75,24.94 INS_C1.17
INS_R1_2
  Bottom 0.152: INS_C1.18 91.28,22.7 94.46,22.7 INS_C0.18
INS_R1_3
  Bottom 0.152: INS_C0.19 91.9,22.4 88.75,22.4 INS_C1.19
INS_R1_4
  Bottom 0.152: INS_C1.20 91.28,20.16 94.46,20.16 INS_C0.20
INS_R2_0
  Bottom 0.152: INS_C0.21 91.9,19.86 88.75,19.86 INS_C1.21
INS_R2_1
  Bottom 0.152: INS_C1.22 91.28,17.62 94.46,17.62 INS_C0.22
INS_R2_2
  Bottom 0.152: INS_C0.23 91.9,17.32 88.75,17.32 INS_C1.23
INS_R2_3
  Bottom 0.152: INS_C1.24 91.28,15.08 94.46,15.08 INS_C0.24
INS_R2_4
  Bottom 0.152: INS_C0.25 91.9,14.78 88.75,14.78 INS_C1.25
INS_WR_0
  Bottom 0.152: INS_C1.8 91.28,35.4 94.46,35.4 INS_C0.8
INS_WR_1
  Bottom 0.152: INS_C0.9 91.9,35.1 88.75,35.1 INS_C1.9
INS_WR_2
  Bottom 0.152: INS_C1.10 91.28,32.86 94.46,32.86 INS_C0.10
INS_WR_3
  Bottom 0.152: INS_C0.11 91.9,32.56 88.75,32.56 INS_C1.11
INS_WR_4
  Bottom 0.152: INS_C1.12 91.28,30.32 94.46,30.32 INS_C0.12
LATCH  (via drill 0.35)
  Top 0.152: IC5.11 55.02,90.71 55.24,90.49 55.24,72.55 | 55.24,72.55 55.24,50.87 | 55.24,50.87 IC7.11 | IC6.11 55.15,72.46 55.24,72.55 | 55.24,50.87 v55.24,31.11 | IC8.11 72.45,29.95 v72.39,30 72.71,30.32 72.71,42.62 v74.77,44.69 | v82.23,43.34 82.23,41.91 82.71,41.43 IC21.11
  Bottom 0.152: v55.24,31.11 55.6,30.76 71.63,30.76 v72.39,30 | v74.77,44.69 76.12,44.69 77.47,43.34 v82.23,43.34
M0O_0  (via drill 0.35)
  Top 0.152: IC1.2 53.66,82.23 v52.39,82.23
  Bottom 0.152: v52.39,82.23 49.69,82.23 49.05,82.87 37.77,82.87 37.36,82.46 35.14,82.46 IC22.13
M0O_1  (via drill 0.35)
  Top 0.152: IC1.3 51.79,81.64 v51.75,81.6 | v38.1,82.23 38.1,81.14 36.73,79.76 IC22.14
  Bottom 0.152: v51.75,81.6 49.85,81.6 48.9,82.55 38.42,82.55 v38.1,82.23
M0O_2  (via drill 0.35)
  Top 0.152: IC1.4 53.69,80.96 v52.39,80.96
  Bottom 0.152: v52.39,80.96 48.26,80.96 47.92,80.62 37.61,80.62 IC22.15
M0O_3  (via drill 0.35)
  Top 0.152: IC1.5 v51.76,80.33 v51.75,80.33 | IC22.17 38.26,80.5 v38.26,79.85
  Bottom 0.152: v51.75,80.33 48.06,80.33 48.04,80.31 38.72,80.31 v38.26,79.85
M0O_4  (via drill 0.35)
  Top 0.152: IC1.6 v52.4,79.69 v52.39,79.69
  Bottom 0.152: v52.39,79.69 50.96,79.69 50.64,80.01 42.85,80.01 IC22.18
M0O_5  (via drill 0.35)
  Top 0.152: IC1.7 51.77,79.03 v51.75,79.06 | v43.18,78.11 43.18,80.13 IC22.19
  Bottom 0.152: v51.75,79.06 51.12,79.06 50.47,79.7 46.69,79.7 45.06,78.08 43.98,78.08 43.95,78.11 v43.18,78.11
M0O_6  (via drill 0.35)
  Top 0.152: IC1.8 52.42,78.39 v52.39,78.42 | v44.45,77.52 44.45,78.86 IC22.20
  Bottom 0.152: v52.39,78.42 45.83,78.42 45.19,77.78 44.7,77.78 v44.45,77.52
M0O_7  (via drill 0.35)
  Top 0.152: IC1.9 51.8,77.73 v51.75,77.79 | v45.38,77.15 v45.38,73.58 | v35.56,70.64 33.66,68.73 33.66,68.47 33.08,67.89 33.08,66.94 33.24,66.77 33.24,65.95 33.02,65.72 33.02,64.53 33.3,64.25 33.3,58.27 IC23.13
  Bottom 0.152: v51.75,77.79 46.01,77.79 v45.38,77.15 | v45.38,73.58 38.5,73.58 35.56,70.64 v35.56,70.64
M0O_8  (via drill 0.35)
  Top 0.152: IC2.2 52.44,61.65 v52.39,61.59 | v37.78,58.47 37.78,55.9 IC23.14
  Bottom 0.152: v52.39,61.59 50.16,61.59 47.3,58.73 38.03,58.73 v37.78,58.47
M0O_9  (via drill 0.35)
  Top 0.152: IC2.3 53.68,60.96 v51.75,60.96
  Bottom 0.152: v51.75,60.96 49.96,60.96 47.42,58.42 38.73,58.42 37.69,57.38 IC23.15
M0O_10  (via drill 0.35)
  Top 0.152: IC2.4 52.41,60.35 v52.39,60.33
  Bottom 0.152: v52.39,60.33 49.85,60.33 48.58,59.05 48.58,57.15 47.92,56.49 40.15,56.49 IC23.17
M0O_11  (via drill 0.35)
  Top 0.152: IC2.5 v51.76,59.7 v51.75,59.69
  Bottom 0.152: v51.75,59.69 49.64,59.69 48.88,58.93 48.88,57.02 48.04,56.19 42.22,56.19 41.8,55.77 IC23.18
M0O_12  (via drill 0.35)
  Top 0.152: IC2.6 v52.4,59.05 v52.39,59.05 | v42.86,55.63 42.86,56.32 IC23.19
  Bottom 0.152: v52.39,59.05 49.85,59.05 49.19,58.4 49.19,56.9 48.17,55.88 43.11,55.88 v42.86,55.63
M0O_13  (via drill 0.35)
  Top 0.152: IC2.7 51.77,58.4 v51.75,58.42
  Bottom 0.152: v51.75,58.42 50.16,58.42 49.49,57.75 49.49,56.77 48.3,55.58 45.08,55.58 IC23.20
M0O_14  (via drill 0.35)
  Top 0.152: IC2.8 52.39,57.75 v52.39,57.78 | v32.38,53.02 v32.38,33.34
  Bottom 0.152: v32.38,53.02 32.86,53.02 32.94,52.94 35.63,52.94 36.03,53.34 46.49,53.34 49.8,56.65 49.8,57.26 50.32,57.78 v52.39,57.78 | v32.38,33.34 34.1,33.34 IC24.13
M0O_15  (via drill 0.35)
  Top 0.152: v31.58,53.02 32.07,52.53 32.07,33.81 31.59,33.33 v31.59,30.64 | IC2.9 51.8,57.1 v51.75,57.15
  Bottom 0.152: v31.58,53.02 31.6,53.02 32.16,52.47 35.59,52.47 36.16,53.03 46.62,53.03 50.1,56.52 50.1,56.93 50.32,57.15 v51.75,57.15 | IC24.14 36.66,30.64 v31.59,30.64
M0O_16  (via drill 0.35)
  Top 0.152: IC3.2 53.66,40.01 v52.39,40.01 | v37.15,39.69 37.64,39.2 37.64,34.16 IC24.15
  Bottom 0.152: v52.39,40.01 47.28,40.01 47.25,39.98 37.44,39.98 v37.15,39.69
M0O_17  (via drill 0.35)
  Top 0.152: IC3.3 53.68,39.37 v51.75,39.37 | v39.37,39.42 39.37,33.35 IC24.17
  Bottom 0.152: v51.75,39.37 51.44,39.69 47.39,39.69 47.38,39.67 39.62,39.67 v39.37,39.42
M0O_18  (via drill 0.35)
  Top 0.152: IC3.4 52.41,38.76 v52.39,38.73 | v41.27,39.05 41.27,34.19 40.64,33.56 40.64,32.54 41.8,31.38 IC24.18
  Bottom 0.152: v52.39,38.73 51.6,38.73 50.95,39.38 47.52,39.38 47.51,39.37 41.59,39.37 v41.27,39.05
M0O_19  (via drill 0.35)
  Top 0.152: IC3.5 53.71,38.1 v51.75,38.1 | v42.86,36.83 41.8,35.77 IC24.19
  Bottom 0.152: v51.75,38.1 50.16,38.1 48.97,36.91 48.03,36.91 47.8,37.13 43.17,37.13 v42.86,36.83
M0O_20  (via drill 0.35)
  Top 0.152: IC3.6 52.4,37.46 v52.39,37.47 | v45.72,34.04 45.72,32.08 IC24.20
  Bottom 0.152: v52.39,37.47 50.8,37.47 49.53,36.2 49.53,35.24 48.58,34.29 45.97,34.29 v45.72,34.04
M0O_21  (via drill 0.35)
  Top 0.152: IC3.7 51.77,36.81 v51.75,36.83 | v35.24,29.37 35,29.13 35,10.13 IC25.13
  Bottom 0.152: v51.75,36.83 50.64,36.83 49.85,36.04 49.85,32.86 46.35,29.37 v35.24,29.37
M0O_22  (via drill 0.35)
  Top 0.152: IC3.8 52.42,36.16 v52.39,36.2 | v35.88,28.81 35.31,28.24 35.31,8.04 IC25.14
  Bottom 0.152: v52.39,36.2 50.8,36.2 50.15,35.55 50.15,32.73 46.39,28.97 37.47,28.97 37.31,28.81 v35.88,28.81
M0O_23  (via drill 0.35)
  Top 0.152: IC3.9 51.8,35.51 v51.75,35.56 | v36.46,28.26 35.61,27.4 35.61,10.28 IC25.15
  Bottom 0.152: v51.75,35.56 50.96,35.56 50.46,35.06 50.46,32.61 46.42,28.57 37.57,28.57 37.26,28.26 v36.46,28.26
M0O_24  (via drill 0.35)
  Top 0.152: IC4.2 72.39,18.41 v71.12,18.41 | v39.37,15.88 39.37,9.42 IC25.17
  Bottom 0.152: v71.12,18.41 53.02,18.41 50.58,15.97 39.47,15.97 v39.37,15.88
M0O_25  (via drill 0.35)
  Top 0.152: IC4.3 72.41,17.78 v70.48,17.78 | v40.64,15.41 40.64,7.79 IC25.18
  Bottom 0.152: v70.48,17.78 70.17,18.1 53.14,18.1 50.7,15.66 40.89,15.66 v40.64,15.41
M0O_26  (via drill 0.35)
  Top 0.152: IC4.4 72.42,17.14 v71.12,17.14 | v41.91,15.11 41.91,9.42 IC25.19
  Bottom 0.152: v71.12,17.14 70.33,17.14 69.69,17.79 53.26,17.79 50.83,15.36 42.16,15.36 v41.91,15.11
M0O_27  (via drill 0.35)
  Top 0.152: IC4.5 v70.48,16.51 | v50.16,14.65 v50.16,6.67
  Bottom 0.152: v70.48,16.51 69.98,16 51.91,16 50.96,15.06 50.58,15.06 v50.16,14.65 | v50.16,6.67 44.3,6.67 IC25.20
M0O_28  (via drill 0.35)
  Top 0.152: IC4.6 71.13,15.87 v71.12,15.88 | v53.34,15.13 53.34,11.48 IC26.13
  Bottom 0.152: v71.12,15.88 70.28,15.88 70.11,15.7 53.91,15.7 v53.34,15.13
M0O_29  (via drill 0.35)
  Top 0.152: IC4.7 70.51,15.22 v70.48,15.24 | v60.33,15.14 60.33,13.97 59.36,13.01 59.36,6.04 v59.69,5.71
  Bottom 0.152: v70.48,15.24 70.17,15.24 70.01,15.4 60.58,15.4 v60.33,15.14 | v59.69,5.71 59.11,5.71 IC26.14
M0O_30  (via drill 0.35)
  Top 0.152: IC4.8 71.16,14.57 v71.12,14.61
  Bottom 0.152: v71.12,14.61 70.48,14.61 69.34,13.46 61.41,13.46 58.09,10.15 IC26.15
M0O_31  (via drill 0.35)
  Top 0.152: IC4.9 70.58,13.92 v70.56,13.89
  Bottom 0.152: v70.56,13.89 69.83,13.16 61.53,13.16 60.63,12.26 IC26.17
MODE  (via drill 0.35)
  Top 0.152: IC22.11 35.24,82.99 35.24,78.58 34.61,77.95 v34.61,77.15 | v40.96,77.15 40.96,71.01 40.76,70.81 40.76,62.35 37.15,58.74 35.37,58.74 35.3,58.8 | IC23.11 35.3,58.8 | 35.3,58.8 35.3,56.57 33.02,54.28 33.02,35.72 | v32.7,10 33.02,10.32 33.02,11.75 | IC26.11 55.55,10.97 v56.52,10 57.15,9.37 v57.15,8.26 | IC24.11 33.09,35.79 33.02,35.72 | 33.02,35.72 33.02,11.75 | IC25.11 33.05,11.78 33.02,11.75 | v77.79,3.65 IC14.8
  Bottom 0.152: v34.61,77.15 v40.96,77.15 | v32.7,10 32.98,10.28 53.66,10.28 56.24,10.28 v56.52,10 | v57.15,8.26 68.9,8.26 73.5,3.65 v77.79,3.65
MUX_SEL_0  (via drill 0.35)
  Top 0.152: v57.94,61.59 58,61.65 IC2.19 | v55.88,82.23 v55.88,61.59 v55.88,40.01 55.88,28.89 53.18,26.19 v53.18,23.5 | v57.63,82.23 57.68,82.28 IC1.19 | IC3.19 57.52,40.06 v57.47,40.01 | IC4.19 76.04,18.47 v76.04,23.5 | v79.53,42.7 IC21.3
  Bottom 0.152: v55.88,61.59 v57.94,61.59 | v55.88,82.23 v57.63,82.23 | v55.88,40.01 v57.47,40.01 67.31,40.01 71.44,44.13 76.04,44.13 77.47,42.7 v79.53,42.7 | v76.04,23.5 v53.18,23.5
MUX_SEL_1  (via drill 0.35)
  Top 0.152: v67.63,82.23 v67.63,67.47 v67.63,50.64 67.63,45.88 65.16,43.41 65.16,38.49 63.18,36.51 v63.18,34.45 | IC21.6 76.2,38.89 75.09,37.78 75.09,32.44 v75.04,32.38
  Bottom 0.152: IC9.19 67.58,82.28 v67.63,82.23 | v67.63,67.47 67.52,67.36 IC10.19 | v67.63,50.64 67.52,50.53 IC11.19 | v63.18,34.45 63.18,33.66 64.45,32.38 v75.04,32.38 IC12.19
N$1  (via drill 0.35)
  Top 0.152: IC21.4 79.38,41.43 80.17,42.23 v80.17,48.26 | v93.34,47.78 IC13.4
  Bottom 0.152: v80.17,48.26 92.87,48.26 v93.34,47.78
N$2  (via drill 0.35)
  Top 0.152: v77.79,11.27 v77.79,4.92 IC14.9 v81.44,4.92 | v71.91,11.27 IC14.1 | IC21.8 82.71,37.62 81.98,36.9 81.98,27.62 85.39,24.22 85.39,16.96 82.94,14.51 v82.94,4.92
  Bottom 0.152: v77.79,11.27 v71.91,11.27 | v81.44,4.92 v82.94,4.92
N$4
  Top 0.152: IC14.4 IC14.3
O0  (via drill 0.35)
  Top 0.152: IC1.18 60.52,81.64 v60.64,81.76 60.64,85.09 60.22,85.51 IC5.2
  Bottom 0.152: v60.64,81.76 60.76,81.64 IC9.18
O1  (via drill 0.35)
  Top 0.152: IC1.17 61.18,80.98 v61.28,81.08 61.28,85.25 60.36,86.16 IC5.3
  Bottom 0.152: v61.28,81.08 61.37,80.98 IC9.17
O2  (via drill 0.35)
  Top 0.152: IC1.16 61.82,80.33 v61.91,80.43 61.91,85.41 60.51,86.81 IC5.4
  Bottom 0.152: v61.91,80.43 62.01,80.33 IC9.16
O3  (via drill 0.35)
  Top 0.152: IC1.15 62.45,79.69 v62.55,79.78 62.55,85.57 60.65,87.46 IC5.5
  Bottom 0.152: v62.55,79.78 62.64,79.69 IC9.15
O4  (via drill 0.35)
  Top 0.152: IC1.14 61.82,79.03 v61.91,79.13 62.68,79.13 63.1,79.55 63.1,85.8 60.79,88.11 IC5.6
  Bottom 0.152: v61.91,79.13 62.01,79.03 IC9.14
O5  (via drill 0.35)
  Top 0.152: IC1.13 61.24,78.39 v61.28,78.42 62.41,78.42 63.41,79.42 63.41,86.29 60.94,88.76 IC5.7
  Bottom 0.152: v61.28,78.42 66.06,78.42 IC9.13
O6  (via drill 0.35)
  Top 0.152: IC1.12 60.17,77.73 60.59,77.73 v60.64,77.79 62.2,77.79 63.71,79.3 63.71,86.78 61.08,89.41 IC5.8
  Bottom 0.152: v60.64,77.79 60.7,77.73 IC9.12
O7  (via drill 0.35)
  Top 0.152: IC1.11 61.21,77.08 v61.28,77.15 62,77.15 64.02,79.17 64.02,87.27 61.23,90.06 IC5.9
  Bottom 0.152: v61.28,77.15 61.34,77.08 IC9.11
O8  (via drill 0.35)
  Top 0.152: IC2.18 60.68,61 60.96,61.28 v60.96,61.91 60.96,66.67 60.38,67.26 IC6.2
  Bottom 0.152: IC10.18 64.49,66.71 60.96,63.18 v60.96,61.91
O9  (via drill 0.35)
  Top 0.152: IC2.17 60.59,60.35 v61.52,61.28 61.52,66.75 60.36,67.91 IC6.3
  Bottom 0.152: IC10.17 64.47,66.06 61.52,63.1 v61.52,61.28
O10  (via drill 0.35)
  Top 0.152: IC2.16 60.72,59.7 62.07,61.05 v62.07,61.91 62.07,66.83 60.33,68.58 59.34,68.58 IC6.4
  Bottom 0.152: IC10.16 64.46,65.41 62.07,63.02 v62.07,61.91
O11  (via drill 0.35)
  Top 0.152: IC2.15 60.63,59.05 62.63,61.04 v62.63,61.28 62.63,66.91 60.33,69.21 IC6.5
  Bottom 0.152: IC10.15 64.44,64.76 62.63,62.95 v62.63,61.28
O12  (via drill 0.35)
  Top 0.152: IC2.14 60.62,58.4 63.18,60.96 v63.18,61.91 63.18,66.99 60.32,69.86 IC6.6
  Bottom 0.152: IC10.14 64.43,64.11 63.18,62.87 v63.18,61.91
O13  (via drill 0.35)
  Top 0.152: IC2.13 60.6,57.75 63.74,60.88 v63.74,61.28 63.74,67.07 60.3,70.51 IC6.7
  Bottom 0.152: IC10.13 64.73,63.46 63.74,62.47 v63.74,61.28
O14  (via drill 0.35)
  Top 0.152: IC2.12 60.59,57.1 64.3,60.8 v64.3,61.91 64.3,67.15 60.29,71.16 IC6.8
  Bottom 0.152: IC10.12 64.72,62.81 64.3,62.39 v64.3,61.91
O15  (via drill 0.35)
  Top 0.152: IC2.11 60.58,56.45 64.85,60.72 v64.85,61.28 64.85,67.23 60.27,71.81 IC6.9
  Bottom 0.152: v64.85,61.28 65.72,61.28 66.1,61.65 IC10.11
O16  (via drill 0.35)
  Top 0.152: IC3.18 60.68,39.41 60.96,39.69 v60.96,44.77 60.96,45.09 60.38,45.67 IC7.2
  Bottom 0.152: IC11.18 63.54,49.88 60.96,47.31 v60.96,44.77
O17  (via drill 0.35)
  Top 0.152: IC3.17 60.66,38.76 61.52,39.61 v61.52,44.13 61.52,45.16 60.36,46.32 IC7.3
  Bottom 0.152: IC11.17 63.84,49.23 61.52,46.91 v61.52,44.13
O18  (via drill 0.35)
  Top 0.152: IC3.16 60.97,38.11 62.07,39.21 v62.07,44.77 62.07,45.24 60.35,46.97 IC7.4
  Bottom 0.152: IC11.16 64.14,48.59 62.07,46.51 v62.07,44.77
O19  (via drill 0.35)
  Top 0.152: IC3.15 60.95,37.46 62.63,39.13 v62.63,44.13 62.63,45.32 60.33,47.62 IC7.5
  Bottom 0.152: IC11.15 64.13,47.94 62.63,46.44 v62.63,44.13
O20  (via drill 0.35)
  Top 0.152: IC3.14 60.94,36.81 63.18,39.05 v63.18,44.77 63.18,45.4 60.32,48.27 IC7.6
  Bottom 0.152: IC11.14 64.43,47.28 63.18,46.04 v63.18,44.77
O21  (via drill 0.35)
  Top 0.152: IC3.13 60.92,36.16 63.74,38.98 v63.74,44.13 63.74,45.48 60.3,48.92 IC7.7
  Bottom 0.152: IC11.13 64.73,46.63 63.74,45.64 v63.74,44.13
O22  (via drill 0.35)
  Top 0.152: IC3.12 60.91,35.51 64.3,38.9 v64.3,44.77 64.3,45.56 60.29,49.57 IC7.8
  Bottom 0.152: IC11.12 65.03,45.98 64.3,45.25 v64.3,44.77
O23  (via drill 0.35)
  Top 0.152: IC3.11 60.89,34.86 64.85,38.82 v64.85,44.13 64.85,45.64 60.27,50.22 IC7.9
  Bottom 0.152: IC11.11 65.14,45.34 64.85,45.04 v64.85,44.13
O24  (via drill 0.35)
  Top 0.152: IC4.18 79.09,17.82 79.69,18.41 v79.69,23.18 79.69,23.81 79.43,24.08 IC8.2
  Bottom 0.152: IC12.18 75.69,28 79.69,23.99 v79.69,23.18
O25  (via drill 0.35)
  Top 0.152: IC4.17 79.08,17.17 80.25,18.34 v80.25,22.54 80.25,23.89 79.41,24.73 IC8.3
  Bottom 0.152: IC12.17 76.34,28 80.25,24.09 v80.25,22.54
O26  (via drill 0.35)
  Top 0.152: IC4.16 79.06,16.52 80.81,18.26 v80.81,23.18 80.81,23.97 79.4,25.38 IC8.4
  Bottom 0.152: IC12.16 76.99,28.16 80.81,24.34 v80.81,23.18
O27  (via drill 0.35)
  Top 0.152: IC4.15 79.05,15.87 81.36,18.18 v81.36,22.54 81.36,24.05 79.38,26.03 IC8.5
  Bottom 0.152: IC12.15 77.64,28.16 81.36,24.43 v81.36,22.54
O28  (via drill 0.35)
  Top 0.152: IC4.14 79.03,15.22 81.92,18.1 v81.92,23.13 81.92,23.93 79.16,26.68 IC8.6
  Bottom 0.152: IC12.14 78.29,28.32 81.92,24.68 v81.92,23.13
O29  (via drill 0.35)
  Top 0.152: IC4.13 79.02,14.57 82.47,18.02 v82.47,22.54 82.47,23.89 79.03,27.33 IC8.7
  Bottom 0.152: IC12.13 78.94,28.32 82.47,24.78 v82.47,22.54
O30  (via drill 0.35)
  Top 0.152: IC4.12 79,13.92 83.03,17.94 v83.03,23.18 83.03,23.97 79.02,27.98 IC8.8
  Bottom 0.152: IC12.12 79.59,28.32 83.03,24.87 v83.03,23.18
O31  (via drill 0.35)
  Top 0.152: IC4.11 79.31,13.27 83.58,17.54 v83.58,22.54 83.58,24.05 79,28.63 IC8.9
  Bottom 0.152: IC12.11 80.24,28.47 83.58,25.12 v83.58,22.54
PC_ADR_0  (via drill 0.35)
  Top 0.152: IC5.19 52.44,85.51 v52.39,85.57
  Bottom 0.152: IC22.10 37.62,87.48 47.94,87.48 49.85,85.57 v52.39,85.57
PC_ADR_1  (via drill 0.35)
  Top 0.152: v51.59,86.2 53.68,86.2 IC5.18
  Bottom 0.152: IC22.9 35.17,86.59 36.37,87.79 48.1,87.79 49.69,86.2 v51.59,86.2
PC_ADR_2  (via drill 0.35)
  Top 0.152: v37.62,93.19 37.62,91.92 37.61,91.91 37.61,90.02 IC22.8 | IC5.17 52.44,86.81 v52.39,86.76
  Bottom 0.152: PC_ADDR_C0.3 5.73,92.71 32.7,92.71 33.18,93.19 v37.62,93.19 | v52.39,86.76 50.88,86.76 47.62,90.02 37.61,90.02 IC22.8
PC_ADR_3  (via drill 0.35)
  Top 0.152: v32.7,91.76 32.7,90.61 IC22.7 | IC5.16 51.74,87.46 v51.59,87.31
  Bottom 0.152: PC_ADDR_C0.4 32.37,91.43 v32.7,91.76 | v51.59,87.31 50.75,87.31 47.74,90.32 36.19,90.32 34.99,89.13 IC22.7
PC_ADR_4  (via drill 0.35)
  Top 0.152: IC5.15 52.48,88.11 v52.39,88.02
  Bottom 0.152: PC_ADDR_C0.5 5.73,90.17 35.23,90.17 IC22.6 37.77,90.63 47.87,90.63 50.48,88.02 v52.39,88.02
PC_ADR_5  (via drill 0.35)
  Top 0.152: IC22.5 35.16,90.69 v35.16,88.19 | IC5.14 51.62,88.76 v51.59,88.74
  Bottom 0.152: PC_ADDR_C0.6 32.4,88.89 33.34,87.95 34.52,87.95 34.92,87.95 v35.16,88.19 | IC22.5 35.23,92.71 37.31,92.71 37.55,92.47 37.85,92.47 38.09,92.71 47.31,92.71 51.28,88.74 v51.59,88.74
PC_ADR_6  (via drill 0.35)
  Top 0.152: IC5.13 53.68,89.38 v52.39,89.38 | IC22.27 48.26,90.5 v48.26,92.55
  Bottom 0.152: PC_ADDR_C0.7 5.73,87.63 35.7,87.63 36.17,88.09 45.85,88.09 IC22.27 | v48.26,92.55 51.44,89.38 v52.39,89.38
PC_ADR_7  (via drill 0.35)
  Top 0.152: v47.62,74.3 49.21,75.88 v49.21,92.55 | v51.59,90.01 53.66,90.01 IC5.12
  Bottom 0.152: PC_ADDR_C0.8 24.46,86.35 29.84,80.96 29.84,74.3 | IC23.10 35.68,63.5 31.11,63.5 29.84,64.77 29.84,74.3 | v47.62,74.3 29.84,74.3 | v49.21,92.55 51.59,90.17 v51.59,90.01
PC_ADR_8  (via drill 0.35)
  Top 0.152: IC6.19 51.8,67.26 v51.75,67.31 | v36.51,63.82 35.54,63.82 IC23.9
  Bottom 0.152: PC_ADDR_C0.9 5.73,85.09 25.09,85.09 29.54,80.64 29.54,64.64 30.99,63.2 33.45,63.2 IC23.9 | v51.75,67.31 49.21,67.31 47.94,66.04 47.94,64.45 47.3,63.8 36.52,63.8 v36.51,63.82
PC_ADR_9  (via drill 0.35)
  Top 0.152: v32.7,62.55 v32.7,64.06 | IC6.18 52.42,67.91 v52.39,67.94
  Bottom 0.152: PC_ADDR_C0.10 25.41,83.81 29.23,79.98 29.23,64.52 30.86,62.89 32.36,62.89 v32.7,62.55 | v32.7,64.06 32.95,63.8 35.53,63.8 IC23.8 36.76,65 37.65,64.11 45.06,64.11 45.72,64.77 45.72,65.41 46.67,66.36 47.62,66.36 49.21,67.94 v52.39,67.94
PC_ADR_10  (via drill 0.35)
  Top 0.152: v31.75,62.33 v31.75,64.06 | IC6.17 51.77,68.56 v51.75,68.58 | IC23.7 35.54,66.36 37.15,66.36 37.61,66.82 37.61,68.09 v38.1,68.58
  Bottom 0.152: PC_ADDR_C0.11 5.73,82.55 25.4,82.55 28.93,79.02 28.93,64.39 30.74,62.59 31.5,62.59 v31.75,62.33 | v31.75,64.06 32.69,65 IC23.7 | v38.1,68.58 38.41,68.89 51.45,68.89 v51.75,68.58
PC_ADR_11  (via drill 0.35)
  Top 0.152: v32.53,66.6 32.21,66.28 32.21,65.33 30.94,64.06 v30.94,62.03 | IC6.16 52.4,69.21 v52.39,69.22 | v38.1,70.8 38.1,69.87 36.73,68.49 IC23.6
  Bottom 0.152: PC_ADDR_C0.12 25.09,81.27 28.63,77.74 28.63,64.27 30.61,62.28 30.69,62.28 v30.94,62.03 | IC23.6 35.84,66.65 32.53,66.65 v32.53,66.6 | v52.39,69.22 53.02,69.85 53.02,70.8 52.7,71.12 38.42,71.12 v38.1,70.8
PC_ADR_12  (via drill 0.35)
  Top 0.152: v30.14,61.73 30.14,63.79 31.75,65.41 31.75,66.67 32.07,66.99 32.07,67.31 v32.38,67.63 33.05,68.29 v33.05,69.19 | v51.75,69.85 53.71,69.85 IC6.15
  Bottom 0.152: PC_ADDR_C0.13 5.73,80.01 24.77,80.01 28.32,76.45 28.32,64.14 30.14,62.32 v30.14,61.73 | v32.38,67.63 32.47,67.54 IC23.5 | v33.05,69.19 51.09,69.19 v51.75,69.85
PC_ADR_13  (via drill 0.35)
  Top 0.152: v47.94,61.59 47.94,65.09 | 47.94,65.09 v47.94,70.48 | v52.39,70.48 52.41,70.51 IC6.14 | IC23.27 47.85,65 47.94,65.09
  Bottom 0.152: PC_ADDR_C0.14 24.46,78.73 28.02,75.17 28.02,65.09 28.02,64.01 29.53,62.5 29.53,61.55 29.91,61.17 32.11,61.17 32.51,61.57 47.92,61.57 v47.94,61.59 | v47.94,70.48 v52.39,70.48
PC_ADR_14  (via drill 0.35)
  Top 0.152: IC6.13 52.03,71.16 51.44,71.75 v51.44,75.49 | v30.8,75.74 28.11,75.74 v26.99,74.61
  Bottom 0.152: PC_ADDR_C0.15 5.73,77.47 7.62,77.47 24.13,77.47 v26.99,74.61 27.39,74.21 27.39,60.24 30.64,56.99 30.64,47.31 28.19,44.86 28.19,40.16 28.98,39.37 35.68,39.37 IC24.10 | v51.44,75.49 31.05,75.49 v30.8,75.74
PC_ADR_15  (via drill 0.35)
  Top 0.152: IC6.12 52.65,71.81 52.39,72.07 v52.39,74.93 | v30.8,74.93 28.26,74.93 v26.67,73.34
  Bottom 0.152: PC_ADDR_C0.16 23.82,76.19 v26.67,73.34 27.09,72.92 27.09,60.11 30.33,56.87 30.33,47.43 27.88,44.98 27.88,40.04 28.86,39.06 33.45,39.06 IC24.9 | v52.39,74.93 v30.8,74.93
PC_ADR_16  (via drill 0.35)
  Top 0.152: v30.8,38.51 v30.8,39.93 | IC7.19 52.44,45.67 v52.39,45.72 | v37.7,44.5 37.7,42.78 36.73,41.8 IC24.8
  Bottom 0.152: PC_ADDR_C0.17 5.73,74.93 23.18,74.93 26.78,71.32 26.78,59.98 30.03,56.74 30.03,47.56 27.58,45.11 27.58,39.91 28.73,38.76 30.55,38.76 v30.8,38.51 | v30.8,39.93 33.18,39.93 33.27,39.83 35.69,39.83 IC24.8 | v52.39,45.72 46.31,45.72 45.34,44.76 37.95,44.76 v37.7,44.5
PC_ADR_17  (via drill 0.35)
  Top 0.152: v29.99,38.2 29.99,40.47 v30.16,40.64 | IC7.18 51.79,46.32 v51.75,46.35 | v35.24,44.77 35.24,41.93 IC24.7
  Bottom 0.152: PC_ADDR_C0.18 22.87,73.65 26.48,70.04 26.48,59.86 29.72,56.61 29.72,47.69 27.27,45.23 27.27,39.7 28.51,38.46 29.74,38.46 v29.99,38.2 | v30.16,40.64 31.43,40.64 31.66,40.87 IC24.7 | v51.75,46.35 46.51,46.35 45.22,45.06 35.53,45.06 v35.24,44.77
PC_ADR_18  (via drill 0.35)
  Top 0.152: v29.18,37.9 29.21,37.93 v29.21,41.91 | IC7.17 52.41,46.97 v52.39,46.99 | v37.78,46.99 37.78,45.42 36.73,44.36 IC24.6
  Bottom 0.152: PC_ADDR_C0.19 5.73,72.39 22.54,72.39 26.18,68.76 26.18,59.73 29.42,56.49 29.42,47.81 26.97,45.36 26.97,39.57 28.39,38.15 28.93,38.15 v29.18,37.9 | v29.21,41.91 29.5,42.2 35.52,42.2 IC24.6 | v52.39,46.99 v37.78,46.99
PC_ADR_19  (via drill 0.35)
  Top 0.152: v28.38,37.59 28.38,42.66 v28.89,43.18 | IC7.16 v51.76,47.62 v51.75,47.62 | v34.29,47.62 34.19,47.52 IC24.5
  Bottom 0.152: PC_ADDR_C0.20 22.55,71.11 25.87,67.79 25.87,59.6 29.11,56.36 29.11,47.94 26.66,45.49 26.66,39.31 v28.38,37.59 | v28.89,43.18 29.12,43.41 IC24.5 | v51.75,47.62 v34.29,47.62
PC_ADR_20  (via drill 0.35)
  Top 0.152: v48.26,37.47 48.26,40.96 | 48.26,40.96 v48.26,48.26 | v52.39,48.26 v52.4,48.27 IC7.15 | IC24.27 46.97,40.96 48.26,40.96
  Bottom 0.152: PC_ADDR_C0.21 5.73,69.85 21.91,69.85 25.57,66.19 25.57,59.48 28.79,56.25 28.79,48.05 26.36,45.61 26.36,38.73 28.05,37.04 30.11,37.04 30.51,37.44 48.23,37.44 v48.26,37.47 | v48.26,48.26 v52.39,48.26
PC_ADR_21  (via drill 0.35)
  Top 0.152: IC7.14 51.77,48.92 v51.75,48.9 | v31.27,48.39 31.25,48.42 v28.17,48.42
  Bottom 0.152: PC_ADDR_C0.22 21.92,68.57 25.26,65.23 25.26,59.35 28.17,56.45 v28.17,48.42 28.17,47.85 26.05,45.74 26.05,38.6 26.67,37.99 26.67,18.41 29.53,15.56 35.41,15.56 IC25.10 | v51.75,48.9 31.78,48.9 v31.27,48.39
PC_ADR_22  (via drill 0.35)
  Top 0.152: IC7.13 52.42,49.57 v52.39,49.53 | v31.27,49.2 27.48,49.2 v27.46,49.21